# Altium project Cabinet_System_F.PrjPcb
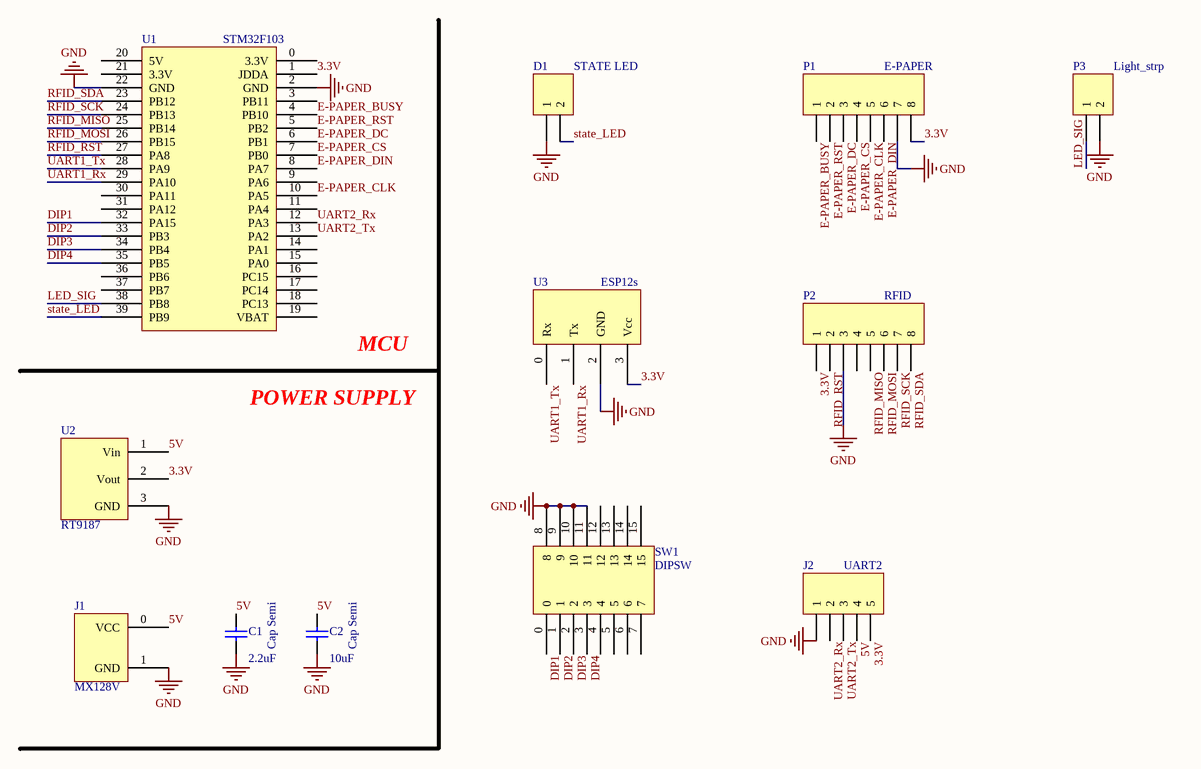
[diagram p0: Cabinet_System_F.SchDoc]
1 sheet, 12 parts. Net scope: global (net labels, ports and power ports of the same name join across sheets).
Board file: Cabinet_System_F.PcbDoc

## Sheet Cabinet_System_F.SchDoc
size A4; SheetNumber: 1; SheetTotal: 1

### Parts
C1  Cap Semi  value 2.2uF  [1608[0603]]
C2  Cap Semi  value 10uF  [1608[0603]]
D1  STATE LED  [HDR1X2]
J1  MX128V  [MX128V]
J2  UART2  [HDR1X5]
P1  E-PAPER  [HDR1X8]
P2  RFID  [HDR1X8]
P3  Light_strp  [HDR1X2]
SW1  DIPSW  [DIPSW]
U1  STM32F103  [STM32F103]
U2  RT9187  [RT9187]
U3  ESP12s  [ESP12s]

### Nets
GND: C1.1 C2.1 D1.1 J1.1(GND) J2.1 P1.7 P2.3 P3.2 SW1.8 SW1.9 SW1.10 SW1.11 U1.2(GND) U1.22(GND) U2.3(GND) U3.2(GND)
3.3V: J2.5 P1.8 P2.1 U1.1(JDDA) U2.2(Vout) U3.3(Vcc)
5V: C1.2 C2.2 J1.0(VCC) J2.4 U2.1(Vin)
DIP1: SW1.0 U1.32(PA15)
DIP2: SW1.1 U1.33(PB3)
DIP3: SW1.2 U1.34(PB4)
DIP4: SW1.3 U1.35(PB5)
E-PAPER_BUSY: P1.1 U1.4(PB10)
E-PAPER_CLK: P1.5 U1.10(PA5)
E-PAPER_CS: P1.4 U1.7(PB0)
E-PAPER_DC: P1.3 U1.6(PB1)
E-PAPER_DIN: P1.6 U1.8(PA7)
E-PAPER_RST: P1.2 U1.5(PB2)
LED_SIG: P3.1 U1.38(PB8)
RFID_MISO: P2.5 U1.25(PB14)
RFID_MOSI: P2.6 U1.26(PB15)
RFID_RST: P2.2 U1.27(PA8)
RFID_SCK: P2.7 U1.24(PB13)
RFID_SDA: P2.8 U1.23(PB12)
state_LED: D1.2 U1.39(PB9)
UART1_Rx: U1.29(PA10) U3.1(Tx)
UART1_Tx: U1.28(PA9) U3.0(Rx)
UART2_Rx: J2.2 U1.12(PA3)
UART2_Tx: J2.3 U1.13(PA2)

Not connected (* = marked no-connect by the designer): P2 4; SW1 4 5 6 7 12 13 14 15; U1 0(3.3V) 3(PB11) 9(PA6) 11(PA4) 14(PA1) 15(PA0) 16(PC15) 17(PC14) 18(PC13) 19(VBAT) 20(5V) 21(3.3V) 30(PA11) 31(PA12) 36(PB6) 37(PB7)

### Notes on the sheet
- MCU
- POWER SUPPLY

### Library data of the parts
C1 C2 = Cap Semi: Capacitor (Semiconductor SIM Model); Published: 8-Jun-2000; LatestRevisionDate: 29-May-2009; LatestRevisionNote: IPC-7351 Footprint Added.; PackageReference: C1206; Publisher: Altium Limited; PackageDescription: Chip Capacitor
D1 P3 = Header 2: Header, 2-Pin; LatestRevisionDate: 17-Jul-2002; LatestRevisionNote: Re-released for DXP Platform.; Publisher: Altium Limited
J2 = Header 5: Header, 5-Pin; LatestRevisionDate: 17-Jul-2002; LatestRevisionNote: Re-released for DXP Platform.; Publisher: Altium Limited
P1 P2 = Header 8: Header, 8-Pin; LatestRevisionDate: 17-Jul-2002; LatestRevisionNote: Re-released for DXP Platform.; Publisher: Altium Limited